# EAGLE design SGOv2 (EAGLE 6.3)
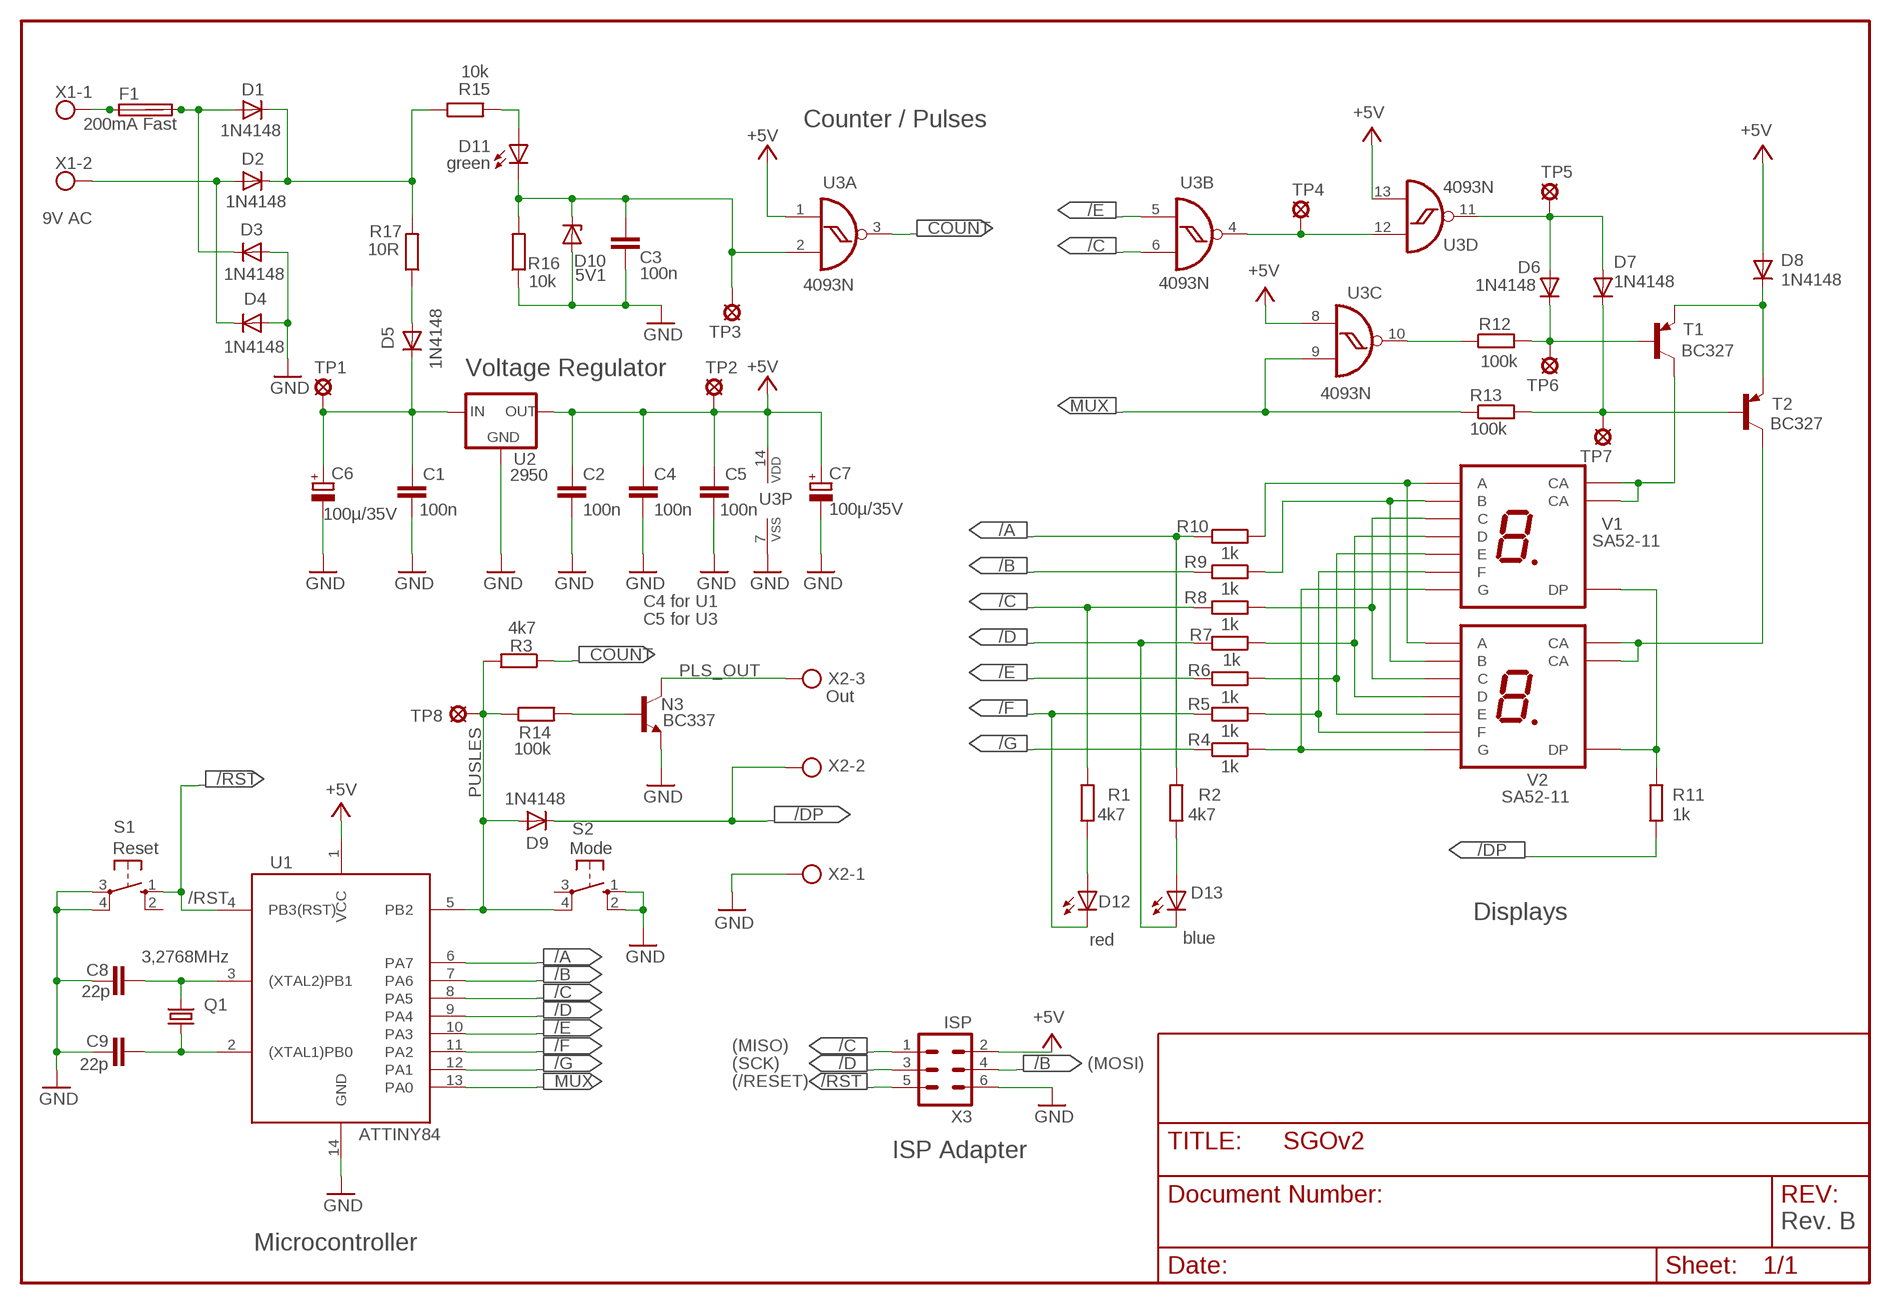
[diagram p0: schematic, sheet 1]

## Parts
C1  100n  C-EU025-024X044  [C025-024X044]
C2  100n  C-EU025-024X044  [C025-024X044]
C3  100n  C-EU025-024X044  [C025-024X044]
C4  100n  C-EU025-024X044  [C025-024X044]
C5  100n  C-EU025-024X044  [C025-024X044]
C6  100µ/35V  CPOL-EUE2.5-7  [E2,5-7]
C7  100µ/35V  CPOL-EUE2.5-7  [E2,5-7]
C8  22p  C-EU025-024X044  [C025-024X044]
C9  22p  C-EU025-024X044  [C025-024X044]
D1  1N4148  [DO35-10]
D2  1N4148  [DO35-10]
D3  1N4148  [DO35-10]
D4  1N4148  [DO35-10]
D5  1N4148  [DO35-10]
D6  1N4148  [DO35-10]
D7  1N4148  [DO35-10]
D8  1N4148  [DO35-10]
D9  1N4148  [DO35-10]
D10  5V1  ZPD  [DO35Z10]
D11  green  LED3MM  [LED3MM]
D12  red  LED3MM  [LED3MM]
D13  blue  LED3MM  [LED3MM]
F1  200mA Fast  SHK20Q  [SHK20Q]
F2  FUSESH22,5  [SH22,5]
N3  BC337  BC337-40  [TO92]
Q1  3,2768MHz  CRYSTALHC49S  [HC49/S]
R1  4k7  R-EU_0207/10  [0207/10]
R2  4k7  R-EU_0207/10  [0207/10]
R3  4k7  R-EU_0207/10  [0207/10]
R4  1k  R-EU_0207/10  [0207/10]
R5  1k  R-EU_0207/10  [0207/10]
R6  1k  R-EU_0207/10  [0207/10]
R7  1k  R-EU_0207/10  [0207/10]
R8  1k  R-EU_0207/10  [0207/10]
R9  1k  R-EU_0207/10  [0207/10]
R10  1k  R-EU_0207/10  [0207/10]
R11  1k  R-EU_0207/10  [0207/10]
R12  100k  R-EU_0207/10  [0207/10]
R13  100k  R-EU_0207/10  [0207/10]
R14  100k  R-EU_0207/10  [0207/10]
R15  10k  R-EU_0207/10  [0207/10]
R16  10k  R-EU_0207/10  [0207/10]
R17  10R  R-EU_0207/10  [0207/10]
S1  Reset  10-XX  [B3F-10XX]
S2  Mode  10-XX  [B3F-10XX]
T1  BC327  [TO92]
T2  BC327  [TO92]
TP1  V+  LSP10  [LSP10]
TP2  +5V  LSP10  [LSP10]
TP3  C-V5  LSP10  [LSP10]
TP4  /EC  LSP10  [LSP10]
TP5  EC  LSP10  [LSP10]
TP6  B-N1  LSP10  [LSP10]
TP7  B-N2  LSP10  [LSP10]
TP8  PLS  LSP10  [LSP10]
U1  ATTINY84  ATTINY24/44/84-PU  [DIL14]
U2  2950  78LXX  [TO92]
U3  4093N  [DIL14]
V1  SA52-11  [KB-SX52-11]
V2  SA52-11  [KB-SX52-11]
X1  9V AC  W237-102  [W237-102]
X2  Out  W237-103  [W237-103]
X3  ISP  ML6  [ML6]

## Nets
+5V: C2.1 C4.1 C5.1 C7.+ D8.A TP2.MP U1.1(VCC) U2.1(OUT) U3.1(A:I0) U3.8(C:I0) U3.13(D:I1) U3.14(P:VDD) X3.2
/A: R2.2 R10.2 U1.6(PA7)
/B: R9.2 U1.7(PA6) X3.4
/C: R1.2 R8.2 U1.8(PA5) U3.6(B:I1) X3.1
/D: D13.K(C) R7.2 U1.9(PA4) X3.3
/DP: D9.C R11.1 X2.2
/E: R6.2 U1.10(PA3) U3.5(B:I0)
/F: D12.K(C) R5.2 U1.11(PA2)
/G: R4.2 U1.12(PA1)
/RST: S1.1(S) U1.4(PB3(RST)) X3.5
COUNT: R3.1 U3.3(A:O)
GND: C1.2 C2.2 C3.2 C4.2 C5.2 C6.- C7.- C8.1 C9.1 D3.A D4.A D10.A N3.3(E) R16.1 S1.3(P) S1.4(P1) S2.1(S) S2.2(S1) U1.14(GND) U2.2(GND) U3.7(P:VSS) X2.1 X3.6
MUX: R13.1 U1.13(PA0) U3.9(C:I1)
N$1: R10.1 V1.P$7(A) V2.P$7(A)
N$2: R9.1 V1.P$6(B) V2.P$6(B)
N$3: R8.1 V1.P$4(C) V2.P$4(C)
N$4: R7.1 V1.P$2(D) V2.P$2(D)
N$5: R6.1 V1.P$1(E) V2.P$1(E)
N$6: R5.1 V1.P$9(F) V2.P$9(F)
N$7: R4.1 V1.P$10(G) V2.P$10(G)
N$8: T2.1(C) V2.P$3(CA) V2.P$8(CA)
N$9: T1.1(C) V1.P$3(CA) V1.P$8(CA)
N$10: D1.A D3.C F1.2A F2.2
N$11: D2.A D4.C X1.2
N$12: D1.C D2.C R15.1 R17.2
N$13: C1.1 C6.+ D5.C TP1.MP U2.3(IN)
N$14: D8.C T1.3(E) T2.3(E)
N$15: D7.C R13.2 T2.2(B) TP7.MP
N$16: D6.C R12.2 T1.2(B) TP6.MP
N$17: R12.1 U3.10(C:O)
N$18: D6.A D7.A TP5.MP U3.11(D:O)
N$19: TP4.MP U3.4(B:O) U3.12(D:I0)
N$20: D12.A R1.1
N$21: C8.2 Q1.2 U1.3((XTAL2)PB1)
N$22: D5.A R17.1
N$23: C9.2 Q1.1 U1.2((XTAL1)PB0)
N$24: C3.1 D10.C D11.K(C) R16.2 TP3.MP U3.2(A:I1)
N$25: D11.A R15.2
N$26: R11.2 V1.P$5(DP) V2.P$5(DP)
N$27: F1.1A F2.1 X1.1
N$28: D13.A R2.1
N$85: N3.2(B) R14.2
PLS_OUT: N3.1(C) X2.3
PUSLES: D9.A R3.2 R14.1 S2.4(P1) TP8.MP U1.5(PB2)
Unconnected: F1.1B F1.2B S1.2(S1) S2.3(P)

## Notes on the sheet
- Counter / Pulses
- Voltage Regulator
- C4 for U1
- C5 for U3
- Displays
- (MISO)
- (SCK) | (MOSI)
- (/RESET)
- ISP Adapter
- Rev. B
- Microcontroller

## Library data of the parts
C1-C5 C8 C9 = 09siemens-sta:C-EU: CAPACITOR, European symbol
C6 C7 = 09siemens-sta:CPOL-EU: POLARIZED CAPACITOR, European symbol
D1-D9 = 09siemens-sta:1N4148: DIODE high speed (Philips)
D10 = diode:ZPD: Z DIODE 500 mW
D11-D13 = 09siemens-sta:LED: LED OSRAM: - CHIPLED LG R971, LG N971, LY N971, LG Q971, LY Q971, LO R971, LY R971 LH N974, LH R974 LS Q976, LO Q976, LY Q976 LO Q996 - Hyper CHIPLED LW Q18S LB Q993, LB Q99A, LB R99A - SideLED LS A670, LO A670, LY A670, LG A670, LP A670 LB A673, LV A673, LT A673, LW A673 LH A674 LY A675 LS A676, LA A676, LO A676, LY A676, LW A676 LS A679, LY A679, LG A679 - Hyper Micro SIDELED® LS Y876, LA Y876, LO Y876, LY Y876 LT Y87S - SmartLED LW L88C, LW L88S LB L89C, LB L89S, LG L890 LS L89K, LO L89K, LY L89K LS L896, LA L896, LO L896, LY L896 - TOPLED LS T670, LO T670, LY T670, LG T670, LP T670 LSG T670, LSP T670, LSY T670, LOP T670, LYG T670 LG T671, LOG T671, LSG T671 LB T673, LV T673, LT T673, LW T673 LH T674 LS T676, LA T676, LO T676, LY T676, LB T676, LH T676, LSB T676, LW T676 LB T67C, LV T67C, LT T67C, LS T67K, LO T67K, LY T67K, LW E67C LS E67B, LA E67B, LO E67B, LY E67B, LB E67C, LV E67C, LT E67C LW T67C LS T679, LY T679, LG T679 LS T770, LO T770, LY T770, LG T770, LP T770 LB T773, LV T773, LT T773, LW T773 LH T774 LS E675, LA E675, LY E675, LS T675 LS T776, LA T776, LO T776, LY T776, LB T776 LHGB T686 LT T68C, LB T68C - Hyper Mini TOPLED® LB M676 - Mini TOPLED Santana® LG M470 LS M47K, LO M47K, LY M47K Source: http://www.osram.convergy.de - LUMILED® LXK2-PW12-R00, LXK2-PW12-S00, LXK2-PW14-U00, LXK2-PW14-V00 LXK2-PM12-R00, LXK2-PM12-S00, LXK2-PM14-U00 LXK2-PE12-Q00, LXK2-PE12-R00, LXK2-PE12-S00, LXK2-PE14-T00, LXK2-PE14-U00 LXK2-PB12-K00, LXK2-PB12-L00, LXK2-PB12-M00, LXK2-PB14-N00, LXK2-PB14-P00, LXK2-PB14-Q00 LXK2-PR12-L00, LXK2-PR12-M00, LXK2-PR14-Q00, LXK2-PR14-R00 LXK2-PD12-Q00, LXK2-PD12-R00, LXK2-PD12-S00 LXK2-PH12-R00, LXK2-PH12-S00 LXK2-PL12-P00, LXK2-PL12-Q00, LXK2-PL12-R00 Source: www.luxeon.com
F1 = 09siemens-sta:SHK20Q: FUSE HOLDER 5 x 20 mm, SH contact, E1207 Buerklin 64G6061
F2 = fuse:FUSE: Fuse; OC_FARNELL: unknown; OC_NEWARK: unknown
N3 = 09siemens-sta:BC337*: NPN Transistor
Q1 = 09siemens-sta:CRYSTAL: CRYSTAL
R1-R17 = 09siemens-sta:R-EU_: RESISTOR, European symbol
S1 S2 = 09siemens-sta:10-XX: OMRON SWITCH
T1 T2 = 09siemens-sta:BC327: PNP Transistor
TP1-TP8 = 09siemens-sta:LSP10: SOLDER PAD drill 1.0 mm, distributor Buerklin, 12H555
U1 = 09siemens-sta:ATTINY24/44/84
U2 = 09siemens-sta:78LXX: VOLTAGE REGULATOR
U3 = 09siemens-sta:4093: Quad 2-input NAND schmitt trigger
V1 V2 = 09siemens-sta:SA52-11
X1 = 09siemens-sta:W237-102: WAGO SCREW CLAMP
X2 = 09siemens-sta:W237-103: WAGO SCREW CLAMP
X3 = 09siemens-sta:ML6: HARTING

## Net classes
1 VCC: width 0.127 mm

## Board
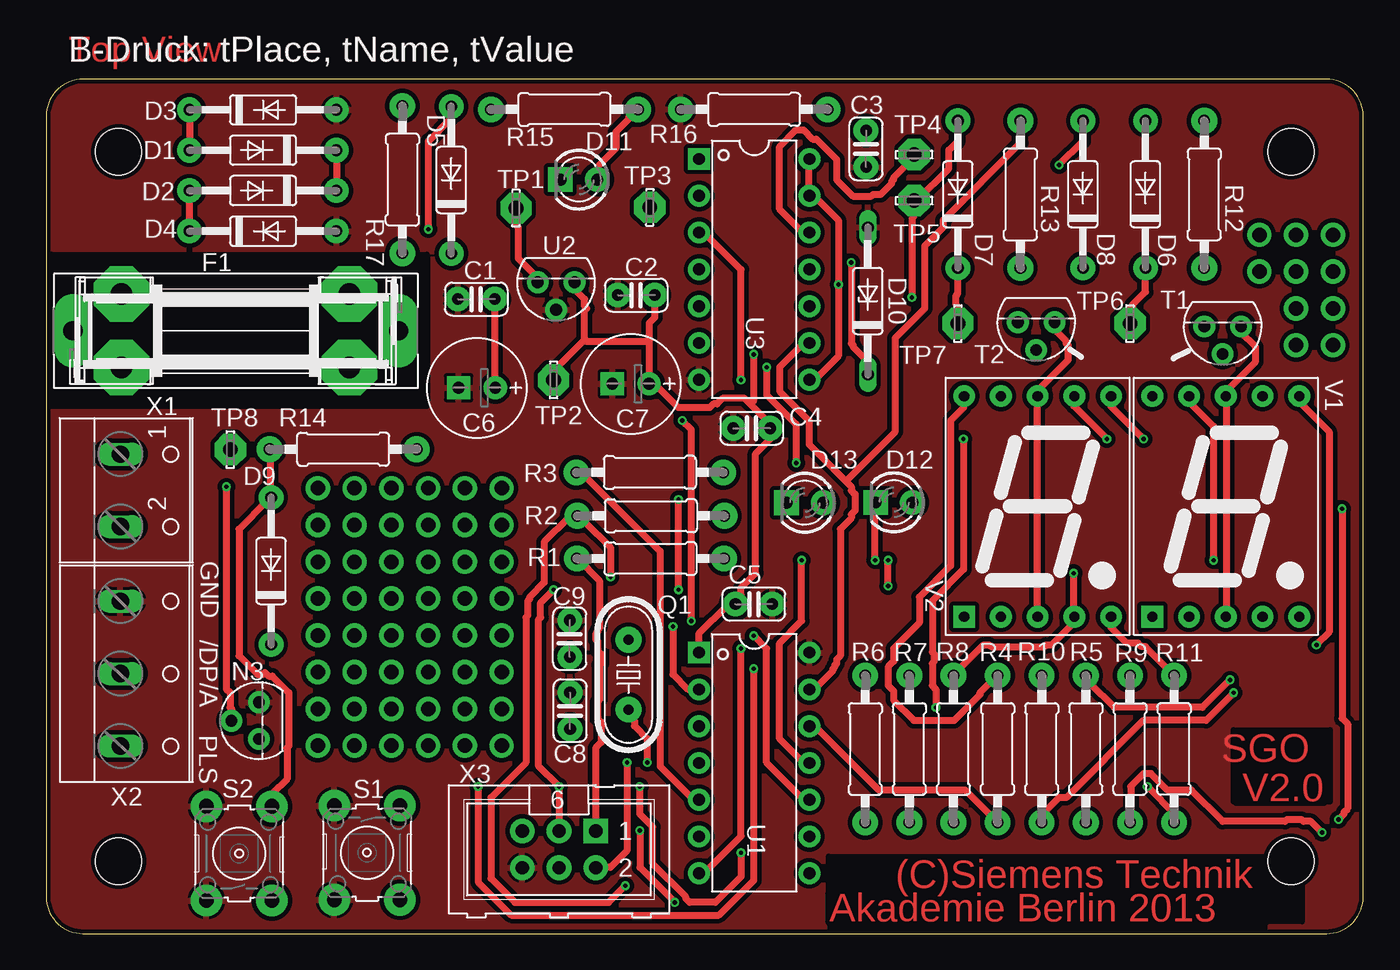
[diagram p1: board, top side]
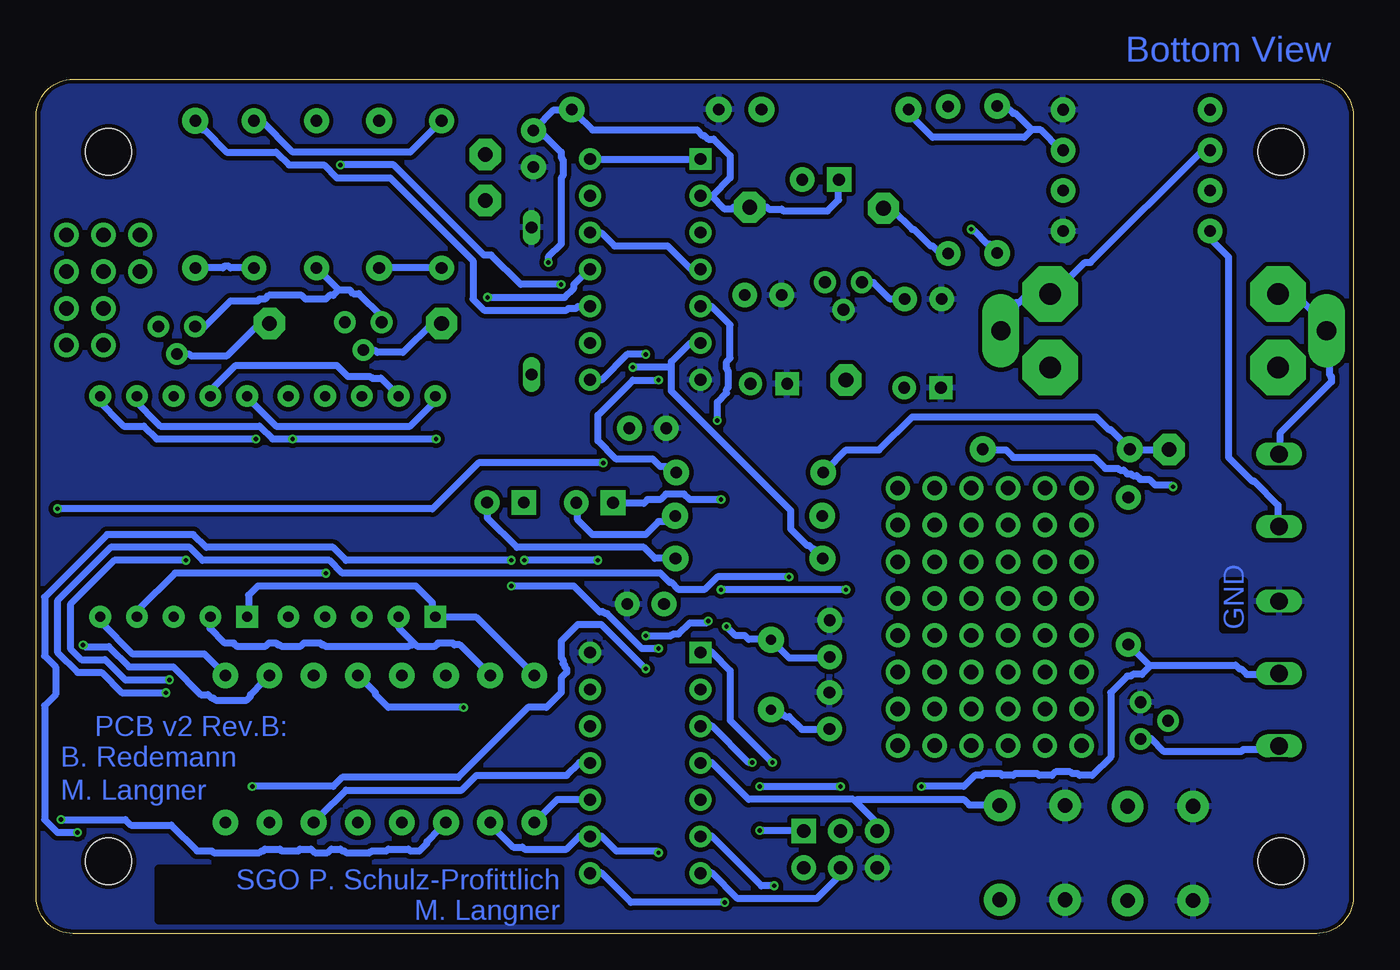
[diagram p2: board, bottom side, seen from below]

Size 91 x 59 mm. Coordinates in mm from the lower left corner, seen from the top.
Outline: 0,56.46 0,2.54 arc90 2.54,0 88.46,0 arc90 91,2.54 91,56.46 arc90 88.46,59 2.54,59 arc90 0,56.46
Copper layers (1*16): Top 0.035mm / dielectric 1.5mm / Bottom 0.035mm
Design rules: minimum track width 0.5mm, minimum drill 0.3mm, track to track 0.3mm, track to pad 0.3mm, pad to pad 0.15mm, via to via 0.15mm, smd to smd 0.15mm, copper to edge 0.3mm, drill to drill 0.2mm, minimum pad ring 0.2mm, minimum via ring 0.15mm, stop-mask expansion 0.075mm, vias tented up to drill 0mil, thermal gap 0.2mm
Holes 3.2 mm at 5,5 5,54 86,5 86,54
tRestrict: area 54.1,0.8 to 86.8,5.3; area 82,9.1 to 88.7,14; area 0.4,36.4 to 26.3,46.9

### Footprints (pad centres in the part's own frame; a part is rotated, then mirrored left to right if it is on the bottom)
C025-024X044 = drill 0.8 pad 1.7: 1 -1.27,0; 2 1.27,0
E2,5-7 = drill 0.813 pad 1.6: + -1.27,0 | drill 0.813 pad 1.6 square: - 1.27,0
DO35-10 = drill 0.8 pad 1.7: A 5.08,0; C -5.08,0
DO35Z10 = drill 0.813 long: A 5.08,0; C -5.08,0
LED3MM = drill 0.813 pad 1.7: A -1.27,0 | drill 0.813 pad 1.7 square: K 1.27,0
SHK20Q = drill 1.5 pad 3.81 octagon: 1A -7.874,2.54; 1B -7.874,-2.54; 2A 7.874,2.54; 2B 7.874,-2.54
SH22,5 = drill 1.321 pad 2.54 long: 1 -11.252,0; 2 11.252,0
TO92 = drill 0.813 pad 1.5: 1 -1.27,0; 2 0,1.905; 3 1.27,0
HC49/S = drill 0.7 pad 1.778: 1 -2.413,0; 2 2.413,0
0207/10 = drill 0.8 pad 1.778: 1 -5.08,0; 2 5.08,0
B3F-10XX = drill 1.016 pad 2.184: 1 -3.251,2.261; 2 3.251,2.261; 3 -3.251,-2.261; 4 3.251,-2.261
LSP10 = drill 1.016 pad 2.159 octagon: MP 0,0
DIL14 = drill 0.813 pad 1.5 square: 1 -7.62,-3.81 | drill 0.813 pad 1.5: 2 -5.08,-3.81; 3 -2.54,-3.81; 4 0,-3.81; 5 2.54,-3.81; 6 5.08,-3.81; 7 7.62,-3.81; 8 7.62,3.81; 9 5.08,3.81; 10 2.54,3.81; 11 0,3.81; 12 -2.54,3.81; 13 -5.08,3.81; 14 -7.62,3.81
KB-SX52-11 = drill 0.7 pad 1.5 square: P$1 -5.08,-7.62 | drill 0.7 pad 1.5: P$2 -2.54,-7.62; P$3 0,-7.62; P$4 2.54,-7.62; P$5 5.08,-7.62; P$6 5.08,7.62; P$7 2.54,7.62; P$8 0,7.62; P$9 -2.54,7.62; P$10 -5.08,7.62
W237-102 = drill 1.194 long: 1 -2.5,-1.27; 2 2.5,-1.27
W237-103 = drill 1.194 long: 1 -5,-1.29; 2 0,-1.29; 3 5,-1.29
ML6 = drill 0.914 pad 1.7 square: 1 -2.54,-1.27 | drill 0.914 pad 1.7: 2 -2.54,1.27; 3 0,-1.27; 4 0,1.27; 5 2.54,-1.27; 6 2.54,1.27

### Placement (x,y rotation side)
C1  29.72,43.81 180 top
C2  40.77,44.09 180 top
C3  56.64,54.2 270 top
C4  48.74,34.9 180 top
C5  48.9,22.76 0 top
C6  29.77,37.69 180 top
C7  40.39,37.97 180 top
C8  36.2,15.39 270 top
C9  36.17,20.37 270 top
D1  14.99,54.1 180 top
D2  14.99,51.31 180 top
D3  14.99,56.9 0 top
D4  14.99,48.51 0 top
D5  27.99,52.04 90 top
D6  75.95,51.05 90 top
D7  62.99,51.05 90 top
D8  71.63,51.05 90 top
D9  15.54,25.04 90 top
D10  56.77,43.69 90 top
D11  36.8,52.07 180 top
D12  58.58,29.78 180 top
D13  52.41,29.75 180 top
F1  13.08,41.63 0 top
F2  13.11,41.63 0 top
N3  14.71,14.71 90 top
Q1  40.23,17.88 270 top
R1  41.75,25.9 180 top
R2  41.78,28.85 180 top
R3  41.71,31.85 180 top
R4  65.74,12.75 270 top
R5  71.83,12.75 270 top
R6  56.59,12.75 270 top
R7  59.64,12.75 270 top
R8  62.69,12.75 270 top
R9  74.88,12.75 270 top
R10  68.78,12.75 270 top
R11  77.93,12.75 90 top
R12  80.01,51.05 270 top
R13  67.31,51.05 270 top
R14  20.52,33.45 0 top
R15  35.81,56.92 0 top
R16  48.92,56.92 0 top
R17  24.61,52.07 90 top
S1  22.17,5.59 270 top
S2  13.34,5.54 90 top
T1  81.28,41.94 180 top
T2  68.4,42.21 180 top
TP1  32.46,50.09 270 top
TP2  35.05,38.23 270 top
TP3  41.71,50.16 90 top
TP4  59.97,53.8 180 top
TP5  59.97,50.62 180 top
TP6  74.88,42.14 90 top
TP7  62.99,42.14 90 top
TP8  12.73,33.43 90 top
U1  48.92,11.79 270 top
U2  35.23,44.98 180 top
U3  48.92,45.87 270 top
V1  81.5,29.5 0 top
V2  68.5,29.5 0 top
X1  6.4,30.61 270 top
X2  6.42,17.96 270 top
X3  35.43,5.82 180 top

### Tracks (layer width: path | path; a pad name or v marks a point on that pad's centre or on a via)
+5V  (via drill 0.3)
  Top 0.5: U3.8 52.83,38.35 53.21,38.35 54.74,39.88 v54.74,44.83 54.74,49.28 53.21,50.8 52.7,50.8 52.7,50.93 U3.13 52.7,51.18 52.7,53.47 U3.14 | D8.A 71.63,54.74 v69.98,53.09 | 41.66,40.89 41.66,42.16 42.04,42.55 C2.1 | 41.66,40.89 C7.+ 41.78,37.85 42.16,37.85 43.69,36.32 45.85,36.32 46.1,36.58 46.35,36.58 46.74,36.96 48.26,36.96 48.64,36.58 | 37.21,41.02 37.21,43.05 37.34,43.18 37.21,43.31 37.21,43.81 36.45,44.58 36.45,44.96 U2.1 | 37.21,41.02 35.05,38.86 TP2.MP | 41.66,40.89 37.34,40.89 37.21,41.02 | U1.1 45.09,19.43 45.09,20.7 46.99,22.61 47.62,22.61 C5.1 47.62,23.11 47.75,23.11 48.01,23.37 48.01,23.88 49.02,24.89 49.02,33.15 50.04,34.16 50.04,34.8 C4.1 50.04,35.05 50.04,35.18 48.64,36.58 | v40.13,11.81 40.13,5.71 38.99,4.57 37.97,4.57 X3.2 | v48.9,40.01 48.9,36.83 48.64,36.58
  Bottom 0.5: U3.1 45.21,53.47 52.7,53.47 U3.14 | v69.98,53.09 66.29,53.09 60.07,46.86 59.56,46.86 57.53,44.83 v54.74,44.83 | v40.13,11.81 43.05,14.73 43.05,18.16 44.32,19.43 45.09,19.43 U1.1 | v48.9,40.01 50.16,40.01 51.94,38.23 52.7,38.23 U3.8
/A  (via drill 0.3)
  Top 0.5: v40.01,3.3 38.86,2.16 32.38,2.16 30.73,3.81 30.73,9.4 33.15,11.81 33.15,21.84 33.27,21.97 33.27,22.99 33.4,23.11 33.4,23.24 34.42,24.26 34.42,27.05 36.07,28.7 36.7,28.7 R2.2 36.7,28.45 37.21,28.45 38.99,26.67 v38.99,24.64 | v82.04,16.64 80.14,14.73 75.82,14.73 70.48,9.4 69.98,9.4 68.83,8.26 68.83,7.75 R10.2
  Bottom 0.5: v40.01,3.3 40.89,3.3 44.32,6.73 45.09,6.73 U1.6 | v82.04,16.64 85.09,16.64 86.49,18.03 88.14,18.03 89.53,19.43 89.53,22.99 85.85,26.67 80.39,26.67 79.5,25.78 70.74,25.78 69.85,24.89 47.88,24.89 47.24,24.26 47.12,24.26 46.61,23.75 44.83,23.75 43.94,24.64 v38.99,24.64
/B  (via drill 0.3)
  Top 0.5: v88.14,6.99 87.38,7.75 86.87,7.75 86.74,7.87 85.72,7.87 85.6,7.75 81.28,7.75 79.12,9.91 77.47,9.91 76.33,11.05 75.82,11.05 74.93,10.16 74.93,7.75 R9.2 | v58.17,24 v58.17,25.78 | v48.01,19.68 48.01,6.73 45.59,4.32 45.09,4.32 45.09,4.19 U1.7
  Bottom 0.5: U1.7 45.09,4.19 44.32,4.19 42.55,2.41 37.08,2.41 35.56,3.94 35.56,4.57 35.43,4.57 X3.4 | v88.14,6.99 89.53,6.99 90.42,7.87 90.42,15.75 89.66,16.51 89.66,18.41 90.42,19.18 90.42,23.24 86.11,27.56 80.14,27.56 79.25,26.67 70.48,26.67 69.6,25.78 v58.17,25.78 | v58.17,24 53.85,24 52.07,22.23 51.82,22.23 51.69,22.1 51.56,22.1 49.15,19.68 v48.01,19.68
/C  (via drill 0.3)
  Top 0.5: v43.43,2.16 41.02,4.57 v41.02,7.11 | v89.28,7.87 89.66,8.26 89.66,8.38 89.92,8.64 89.92,14.48 89.53,14.86 v89.53,29.34 | v51.82,32.51 51.82,35.18 49.78,37.21 v49.78,39.12 | X3.1 37.97,12.83 38.35,13.21 38.35,14.61 38.1,14.86 38.1,16 38.23,16.13 38.23,18.54 38.35,18.67 38.35,19.3 38.1,19.56 38.1,20.19 37.97,20.32 37.97,20.7 38.1,20.83 38.1,20.95 38.23,21.08 38.23,24.38 36.7,25.91 R1.2
  Bottom 0.5: v43.43,2.16 49.91,2.16 51.94,4.19 52.7,4.19 U1.8 | v41.02,7.11 37.97,7.11 X3.1 | 47.12,39.12 47.12,37.47 38.86,29.21 38.86,27.94 37.72,26.8 37.59,26.8 37.34,26.54 37.21,26.54 37.08,26.42 37.08,25.91 36.7,25.91 R1.2 | 47.12,39.12 47.12,39.5 45.85,40.77 45.21,40.77 U3.6 | v89.28,7.87 84.84,7.87 84.45,7.49 81.66,7.49 79.88,5.71 78.87,5.71 78.74,5.59 75.56,5.59 75.44,5.71 75.31,5.71 75.18,5.84 74.17,5.84 74.04,5.71 72.9,5.71 72.77,5.84 72.01,5.84 71.75,5.59 70.87,5.59 70.61,5.84 69.98,5.84 69.85,5.71 69.72,5.71 69.6,5.59 67.94,5.59 67.82,5.71 66.8,5.71 66.67,5.84 65.28,5.84 65.15,5.71 64.52,5.71 64.01,6.22 64.01,6.35 63.12,7.24 63.12,7.49 62.99,7.62 62.74,7.62 R8.2 | v89.53,29.34 63.63,29.34 60.45,32.51 v51.82,32.51 | 47.12,39.12 v49.78,39.12
/D  (via drill 0.3)
  Top 0.5: X3.3 v35.43,10.16 34.04,11.56 34.04,21.72 34.16,21.84 34.16,22.86 v35.05,23.75 | v41.02,10.16 41.02,8.26 41.91,7.37 41.91,4.83 44.2,2.54 44.2,2.41 44.45,2.16 46.23,2.16 48.01,3.94 v48.01,5.59 | v43.69,23.75 v43.69,29.97
  Bottom 0.5: R7.2 59.56,7.62 59.18,7.62 59.18,7.11 58.04,5.97 57.4,5.97 57.28,5.84 54.36,5.84 53.47,6.73 52.83,6.73 U1.9 52.58,6.73 51.94,6.73 50.93,5.71 48.13,5.71 v48.01,5.59 | v41.02,10.16 v35.43,10.16 | v43.69,29.97 45.85,29.97 46.23,30.35 47.5,30.35 47.88,29.97 48.77,29.97 49.02,29.72 51.05,29.72 D13.K | v35.05,23.75 v43.69,23.75
/DP  (via drill 0.3)
  Top 0.5: v76.07,10.16 77.98,8.26 77.98,7.75 R11.1 | v48.9,18.29 48.9,3.68 46.48,1.27 32.13,1.27 29.84,3.56 v29.84,10.16
  Bottom 0.5: 14.1,18.54 8.13,18.54 7.87,18.29 7.75,18.29 7.37,17.91 5.21,17.91 X2.2 | 14.1,18.54 15.37,19.81 15.37,19.94 15.49,19.94 D9.C | v76.07,10.16 70.48,10.16 69.85,10.79 61.85,10.79 57.02,15.62 55.75,15.62 54.74,16.64 54.74,17.65 54.36,18.03 54.36,18.29 54.48,18.41 54.48,18.54 54.61,18.67 54.61,18.92 54.74,19.05 54.74,20.19 53.59,21.34 51.94,21.34 v48.9,18.29 | v29.84,10.16 26.92,10.16 26.16,10.92 25.65,10.92 25.53,11.05 24.38,11.05 24.26,10.92 23.5,10.92 23.37,11.05 21.84,11.05 21.72,10.92 20.83,10.92 20.57,11.18 19.56,11.18 19.43,11.05 19.05,11.05 18.92,10.92 18.03,10.92 16.76,12.19 16.76,16.64 15.62,17.78 15.37,17.78 15.24,17.91 14.61,17.91 14.1,18.41 14.1,18.54
/E  (via drill 0.3)
  Top 0.5: v43.94,35.43 44.58,34.8 v44.58,21.59 | v48.9,20.57 49.78,19.68 49.78,11.81 52.2,9.4 52.7,9.4 52.7,9.27 U1.10
  Bottom 0.5: U1.10 52.83,9.27 54.99,9.27 56.13,8.13 56.13,7.62 56.52,7.62 R6.2 | v43.94,35.43 43.94,36.7 43.31,37.34 43.31,37.59 43.18,37.72 43.18,38.86 43.31,38.99 43.31,39.5 43.05,39.75 43.05,42.04 44.32,43.31 45.09,43.31 U3.5 | v44.58,21.59 44.7,21.46 45.85,21.46 46.61,20.7 46.99,20.7 47.12,20.57 v48.9,20.57
/F  (via drill 0.3)
  Top 0.5: v57.28,25.78 57.28,29.72 D12.K | v52.2,25.78 52.2,21.59 50.67,20.07 50.67,13.46 52.2,11.94 52.7,11.94 52.7,11.81 U1.11
  Bottom 0.5: U1.11 52.83,11.81 53.47,11.81 54.36,10.92 60.58,10.92 61.59,9.91 69.6,9.91 71.37,8.13 71.37,7.62 71.75,7.62 R5.2 | v52.2,25.78 v57.28,25.78
/G
  Top 0.5: U1.12 52.83,14.22 53.21,14.22 57.53,9.91 63.5,9.91 65.28,8.13 65.79,8.13 65.79,7.75 R4.2
/RST
  Bottom 0.5: 34.42,9.14 33.02,7.75 33.02,7.11 32.89,7.11 X3.5 | 34.42,9.14 34.54,9.27 41.78,9.27 44.32,11.81 45.09,11.81 U1.4 | S1.1 24.51,8.89 26.54,8.89 26.92,9.27 34.29,9.27 34.42,9.14
COUNT  (via drill 0.3)
  Top 0.5: v48.01,38.23 48.01,45.85 45.59,48.26 45.59,48.39 45.21,48.39 U3.3
  Bottom 0.5: v48.01,38.23 49.78,38.23 52.2,35.81 52.2,34.04 50.93,32.77 48.39,32.77 47.88,32.26 47.5,32.26 47.12,31.88 46.86,31.88 R3.1
GND
  pour Bottom: 98.15,65.43 98.15,64.26 98.48,-2.84 -4.62,-2.84 -4.62,65.48
  pour Top: -4.5,65.33 98.15,65.33 98.55,65.33 98.55,-3 -4.5,-3 -4.5,65.28
MUX
  Top 0.5: 55.24,31.24 52.7,33.78 52.7,35.43 50.67,37.47 50.67,39.12 52.2,40.64 52.7,40.64 52.7,40.77 U3.9 | 55.24,31.24 55.63,30.86 55.63,30.61 55.88,30.35 55.88,29.21 55.63,28.96 55.63,28.7 54.86,27.94 54.86,19.18 54.61,18.92 54.61,18.67 54.48,18.54 54.48,18.41 54.36,18.29 54.36,18.16 53.21,17.02 53.21,16.89 52.83,16.89 U1.13 | R13.1 67.31,54.61 61.98,49.28 61.98,48.77 60.71,47.5 60.71,43.18 58.67,41.15 58.67,34.67 55.24,31.24
N$1  (via drill 0.3)
  Top 0.5: v73.28,34.16 70.99,36.45 70.99,37.08 V2.P$7 | v61.47,15.62 61.47,16.89 61.21,17.14 61.21,18.67 61.34,18.8 61.34,19.3 61.21,19.43 61.21,22.99 63.37,25.15 v63.37,34.16
  Bottom 0.5: V1.P$7 84.07,37.08 84.33,37.08 84.33,36.96 82.42,35.05 75.56,35.05 74.68,34.16 v73.28,34.16 v63.37,34.16 | v61.47,15.62 66.67,15.62 67.56,16.51 67.56,16.64 68.33,17.4 68.33,17.65 68.45,17.78 68.71,17.78 R10.1
N$2  (via drill 0.3)
  Top 0.5: v75.82,34.16 73.53,36.45 73.53,37.08 V2.P$6 | v87.76,19.94 88.65,20.83 88.65,34.67 86.61,36.7 86.61,37.08 V1.P$6
  Bottom 0.5: v75.82,34.16 82.68,34.16 83.57,35.05 84.96,35.05 86.87,36.96 86.87,37.08 86.61,37.08 V1.P$6 | v87.76,19.94 87.63,19.81 85.98,19.81 84.58,18.41 81.53,18.41 79.63,16.51 79.12,16.51 78.87,16.26 78.74,16.26 78.61,16.13 76.45,16.13 76.2,16.38 76.2,16.51 75.31,17.4 75.31,17.65 75.18,17.78 74.93,17.78 R9.1
N$3  (via drill 0.3)
  Top 0.5: R8.1 62.74,17.91 62.74,18.03 62.87,18.03 64.77,19.94 65.15,19.94 65.28,19.81 68.96,19.81 69.09,19.94 69.47,19.94 70.99,21.46 70.99,21.84 V2.P$4 70.99,22.1 v70.99,24.89
  Bottom 0.5: v70.99,24.89 81.41,24.89 83.95,22.35 83.95,21.97 V1.P$4
N$4
  Bottom 0.5: 64.9,20.07 64.64,19.81 63.5,19.81 63.25,20.07 62.23,20.07 62.1,19.94 61.72,19.94 60.07,18.29 60.07,17.78 59.69,17.78 R7.1 | 64.9,20.07 65.91,21.08 65.91,21.84 V2.P$2 | V1.P$2 78.99,21.84 78.99,21.08 77.98,20.07 77.34,20.07 77.09,19.81 75.18,19.81 74.93,20.07 74.42,20.07 74.3,19.94 74.17,19.94 74.04,19.81 72.77,19.81 72.52,20.07 71.37,20.07 71.25,19.94 71.12,19.94 70.99,19.81 65.28,19.81 65.15,19.94 65.02,19.94 64.9,20.07
N$5
  Bottom 0.5: R6.1 56.64,17.78 57.02,17.78 57.02,18.29 60.58,21.84 63.37,21.84 V2.P$1 63.5,22.1 63.63,22.1 63.63,22.86 64.77,24 75.69,24 76.33,23.37 76.33,21.97 V1.P$1
N$6  (via drill 0.3)
  Top 0.5: v81.79,17.53 79.88,15.62 73.79,15.62 72.14,17.27 72.01,17.27 71.88,17.4 71.88,17.78 R5.1 | v80.64,25.78 80.64,35.05 78.99,36.7 78.99,37.08 V1.P$9
  Bottom 0.5: V2.P$9 66.04,37.21 67.18,38.35 67.82,38.35 67.94,38.48 69.47,38.48 70.23,39.24 77.22,39.24 78.87,37.59 78.87,37.21 V1.P$9 | v81.79,17.53 84.84,17.53 86.23,18.92 87.88,18.92 88.65,19.68 88.65,22.73 85.6,25.78 v80.64,25.78
N$7
  Top 0.5: R4.1 65.66,17.78 64.52,16.64 64.52,16.51 62.74,14.73 59.94,14.73 58.55,16.13 58.55,16.76 58.17,17.14 58.17,18.41 58.55,18.8 58.55,19.68 60.33,21.46 60.33,23.24 62.48,25.4 62.48,35.43 63.37,36.32 63.37,37.08 V2.P$10
  Bottom 0.5: V2.P$10 63.5,37.08 63.5,36.7 65.15,35.05 74.42,35.05 76.45,37.08 V1.P$10
N$8
  Top 0.5: V2.P$3 68.45,21.97 68.45,37.08 V2.P$8 68.45,37.34 68.45,37.47 70.61,39.62 70.61,40.64 70.48,40.77 70.48,40.89 69.72,41.66 69.72,42.16 T2.1
N$9
  Top 0.5: V1.P$3 81.53,21.97 81.53,37.08 V1.P$8 81.53,37.34 81.53,37.47 83.57,39.5 83.57,40.51 82.55,41.53 T1.1
N$10
  Top 0.5: D3.C D1.A
  Bottom 0.5: D1.A 10.41,54.1 18.16,46.35 18.54,46.35 19.68,45.21 19.68,44.2 20.95,44.2 F1.2A 21.08,44.2 22.48,44.2 23.11,43.56 23.37,43.56 23.37,42.16 23.88,41.66 24.26,41.66 F2.2
N$11
  Top 0.5: D4.C D2.A
  Bottom 0.5: D4.C 9.78,48.51 9.78,47.88 8.64,46.74 8.64,32.89 6.99,31.24 6.86,31.24 5.21,29.59 5.21,28.19 X1.2
N$12
  Top 0.5: D1.C D2.C
  Bottom 0.5: R17.2 24,57.15 23.5,56.64 23.37,56.64 22.23,55.5 | 22.23,55.5 21.59,55.5 20.19,54.1 D1.C | 22.23,55.5 22.73,54.99 29.08,54.99 30.48,56.39 30.48,56.9 30.73,56.9 R15.1
N$13
  Top 0.5: C1.1 30.99,37.72 C6.+ | TP1.MP 32.51,50.04 32.51,48.9 32.64,48.77 32.64,46.61 33.91,45.34 33.91,45.09 U2.3
  Bottom 0.5: D5.C 28.07,46.99 28.57,46.99 29.08,47.5 29.21,47.5 30.35,48.64 30.48,48.64 31.88,50.04 32.38,50.04 TP1.MP | C1.1 32,43.81 33.15,44.96 33.91,44.96 U2.3
N$14
  Bottom 0.5: 70.1,44.45 69.34,44.45 69.09,44.2 68.71,44.2 67.18,42.67 67.18,42.29 T2.3 | 70.1,44.45 71.5,45.85 71.5,45.97 D8.C | 70.1,44.45 70.48,44.07 70.74,44.07 70.99,43.81 72.39,43.81 72.64,44.07 74.93,44.07 75.18,43.81 75.56,43.81 75.69,43.69 77.6,43.69 79.38,41.91 80.01,41.91 T1.3
N$15
  Top 0.5: D7.C 62.99,44.2 62.87,44.07 62.87,43.43 62.99,43.31 TP7.MP
  Bottom 0.5: T2.2 68.33,40.26 67.56,40.26 67.44,40.13 65.66,40.13 63.63,42.16 62.99,42.16 TP7.MP | D7.C R13.2
N$16
  Top 0.5: D6.C 75.95,44.32 75.06,43.43 75.06,43.31 74.93,43.18 74.93,42.16 TP6.MP
  Bottom 0.5: T1.2 81.28,40.01 80.39,40.01 80.26,39.88 77.85,39.88 75.56,42.16 74.93,42.16 TP6.MP | R12.2 78.11,45.97 77.98,46.1 77.72,46.1 77.6,45.97 D6.C
N$17
  Bottom 0.5: R12.1 79.63,56.13 79.63,55.63 79.5,55.5 79.38,55.5 77.85,53.98 74.42,53.98 73.53,53.09 71.12,53.09 70.23,52.2 66.55,52.2 60.83,46.48 60.83,43.81 60.07,43.05 54.36,43.05 54.23,43.18 53.72,43.18 53.59,43.31 52.83,43.31 U3.10
N$18  (via drill 0.3)
  Top 0.5: v59.82,43.94 59.82,49.4 59.94,49.53 59.94,50.55 TP5.MP 60.2,50.67 62.36,52.83 62.36,54.1 62.99,54.74 D7.A
  Bottom 0.5: v59.82,43.94 54.48,43.94 53.85,44.58 53.85,44.83 52.83,45.85 U3.11 | D6.A 75.44,56.13 73.28,53.98 65.15,53.98 63.12,56.01 63.12,56.13 D7.A
N$19
  Top 0.5: TP4.MP 59.94,53.72 59.94,53.21 59.82,53.09 59.44,53.09 58.55,52.2 58.55,52.07 58.42,51.94 58.42,51.82 57.66,51.05 57.15,51.05 57.02,50.93 55.75,50.93 54.61,52.07 54.61,53.47 53.21,54.86 52.96,54.86 52.32,55.5 51.82,55.5 50.67,54.36 50.67,50.04 52.58,48.13 52.7,48.13 52.7,48.39 U3.12
  Bottom 0.5: U3.4 45.21,45.85 45.72,45.85 47.37,47.5 51.05,47.5 51.94,48.39 52.7,48.39 U3.12
N$20
  Bottom 0.5: D12.A 59.82,29.72 59.82,28.7 57.78,26.67 49.02,26.67 48.26,25.91 46.86,25.91 R1.1
N$21  (via drill 0.3)
  Top 0.5: v41.53,11.81 41.53,13.46 40.64,14.35 40.64,14.73 40.26,15.11 40.26,15.37 Q1.2
  Bottom 0.5: v41.53,11.81 41.78,11.81 44.32,14.35 45.09,14.35 U1.3 | C8.2 36.2,14.1 38.1,14.1 38.99,14.99 39.24,14.99 39.37,15.11 39.5,15.11 39.88,15.49 40.13,15.49 Q1.2
N$22  (via drill 0.3)
  Top 0.5: v26.42,48.64 26.42,54.74 27.94,56.26 27.94,57.02 D5.A
  Bottom 0.5: v26.42,48.64 26.29,48.51 26.16,48.51 25.27,47.62 25.15,47.62 25.02,47.5 25.02,46.99 R17.1
N$23  (via drill 0.3)
  Top 0.5: v43.31,21.21 43.31,17.91 44.32,16.89 45.09,16.89 U1.2
  Bottom 0.5: v43.31,21.21 42.67,20.57 42.04,20.57 41.78,20.32 40.26,20.32 Q1.1 40.13,20.07 40.01,20.07 38.99,19.05 36.2,19.05 C9.2
N$24  (via drill 0.3)
  Top 0.5: D10.C 56.77,39.5 55.75,40.51 55.75,40.64 55.63,40.77 v55.63,46.35
  Bottom 0.5: 44.32,50.93 45.09,50.93 U3.2 | 44.32,50.93 43.43,50.04 42.93,50.04 42.8,50.16 TP3.MP 40.51,50.16 40.39,50.04 39.5,50.04 39.37,49.91 36.32,49.91 35.56,50.67 35.56,52.07 D11.K | v55.63,46.35 55.63,46.74 54.74,47.62 54.74,52.2 54.61,52.32 54.61,53.47 54.74,53.59 54.74,53.98 55.88,55.12 56.01,55.12 56.39,55.5 56.64,55.5 C3.1 56.52,55.63 55.24,56.9 54.1,56.9 R16.2 54.1,56.64 53.72,56.64 52.58,55.5 45.34,55.5 44.96,55.12 44.83,55.12 44.58,54.86 44.2,54.86 43.05,53.72 43.05,52.2 44.32,50.93
N$25
  Top 0.5: R15.2 40.89,56.52 40.39,56.52 40.26,56.39 40.26,56.26 39.37,55.37 39.37,54.23 38.1,52.96 38.1,52.07 D11.A
N$26
  Top 0.5: V2.P$5 73.53,21.84 73.53,21.21 74.68,20.07 75.44,20.07 75.69,19.81 75.95,19.81 77.47,18.29 77.98,18.29 77.98,17.91 R11.2
  Bottom 0.5: V1.P$5 86.49,21.84 86.49,21.46 84.33,19.3 79.38,19.3 78.36,18.29 78.36,17.78 77.98,17.78 R11.2
N$27
  Bottom 0.5: X1.1 5.08,33.15 5.08,34.54 1.52,38.1 1.52,38.48 1.65,38.61 1.65,41.66 1.78,41.66 F2.1 1.78,41.91 4.06,44.2 5.21,44.2 F1.1A
N$28
  Bottom 0.5: D13.A 53.59,29.72 53.59,28.57 52.58,27.56 48.9,27.56 48.01,28.45 47.5,28.45 47.12,28.83 46.86,28.83 R2.1
N$29  (via drill 1 pad 1.68)
  other vias: 28.93,25.68
N$30  (via drill 1 pad 1.68)
  other vias: 28.93,23.14
N$31  (via drill 1 pad 1.68)
  other vias: 28.93,20.6
N$32  (via drill 1 pad 1.68)
  other vias: 23.85,20.6
N$33  (via drill 1 pad 1.68)
  other vias: 26.39,20.6
N$34  (via drill 1 pad 1.68)
  other vias: 26.39,23.14
N$35  (via drill 1 pad 1.68)
  other vias: 26.39,25.68
N$36  (via drill 1 pad 1.68)
  other vias: 23.85,25.68
N$37  (via drill 1 pad 1.68)
  other vias: 21.31,25.68
N$38  (via drill 1 pad 1.68)
  other vias: 28.93,18.06
N$39  (via drill 1 pad 1.68)
  other vias: 28.93,15.52
N$40  (via drill 1 pad 1.68)
  other vias: 28.93,12.98
N$41  (via drill 1 pad 1.68)
  other vias: 23.85,12.98
N$42  (via drill 1 pad 1.68)
  other vias: 26.39,12.98
N$43  (via drill 1 pad 1.68)
  other vias: 26.39,15.52
N$44  (via drill 1 pad 1.68)
  other vias: 26.39,18.06
N$45  (via drill 1 pad 1.68)
  other vias: 21.31,23.14
N$46  (via drill 1 pad 1.68)
  other vias: 23.85,23.14
N$47  (via drill 1 pad 1.68)
  other vias: 21.31,20.6
N$48  (via drill 1 pad 1.68)
  other vias: 18.77,20.6
N$49  (via drill 1 pad 1.68)
  other vias: 18.77,23.14
N$50  (via drill 1 pad 1.68)
  other vias: 18.77,25.68
N$52  (via drill 1 pad 1.68)
  other vias: 28.93,30.76
N$53  (via drill 1 pad 1.68)
  other vias: 28.93,28.22
N$54  (via drill 1 pad 1.68)
  other vias: 23.85,28.22
N$55  (via drill 1 pad 1.68)
  other vias: 26.39,28.22
N$56  (via drill 1 pad 1.68)
  other vias: 26.39,30.76
N$60  (via drill 1 pad 1.68)
  other vias: 21.31,30.76
N$61  (via drill 1 pad 1.68)
  other vias: 23.85,18.06
N$62  (via drill 1 pad 1.68)
  other vias: 21.31,18.06
N$63  (via drill 1 pad 1.68)
  other vias: 21.31,15.52
N$64  (via drill 1 pad 1.68)
  other vias: 23.85,15.52
N$65  (via drill 1 pad 1.68)
  other vias: 21.31,12.98
N$66  (via drill 1 pad 1.68)
  other vias: 18.77,12.98
N$67  (via drill 1 pad 1.68)
  other vias: 18.77,15.52
N$68  (via drill 1 pad 1.68)
  other vias: 18.77,18.06
N$69  (via drill 1 pad 1.68)
  other vias: 23.85,30.76
N$70  (via drill 1 pad 1.68)
  other vias: 21.31,28.22
N$71  (via drill 1 pad 1.68)
  other vias: 18.77,28.22
N$72  (via drill 1 pad 1.68)
  other vias: 18.77,30.76
N$77  (via drill 1 pad 1.68)
  other vias: 31.47,12.98
N$78  (via drill 1 pad 1.68)
  other vias: 31.47,15.52
N$79  (via drill 1 pad 1.68)
  other vias: 31.47,18.06
N$83  (via drill 1 pad 1.68)
  other vias: 31.47,20.6
N$84  (via drill 1 pad 1.68)
  other vias: 31.47,23.14
N$85  (via drill 0.3)
  Top 0.5: v12.45,30.86 12.45,16.89 12.7,16.64 12.7,15.62 12.83,15.49 12.83,14.73 N3.2
  Bottom 0.5: v12.45,30.86 12.57,30.99 13.72,30.99 14.1,31.37 14.73,31.37 14.99,31.62 15.24,31.62 15.37,31.75 15.62,31.75 15.88,32 16.13,32 16.26,32.13 17.14,32.13 17.91,32.89 23.5,32.89 24,33.4 25.53,33.4 R14.2
N$86  (via drill 1 pad 1.68)
  other vias: 31.47,25.68
N$90  (via drill 1 pad 1.68)
  other vias: 31.47,28.22
N$91  (via drill 1 pad 1.68)
  other vias: 31.47,30.76
N$97  (via drill 1 pad 1.68)
  other vias: 83.82,48.26
N$98  (via drill 1 pad 1.68)
  other vias: 86.36,48.26
N$99  (via drill 1 pad 1.68)
  other vias: 88.9,48.26
N$100  (via drill 1 pad 1.68)
  other vias: 88.9,45.72
N$101  (via drill 1 pad 1.68)
  other vias: 86.36,45.72
N$102  (via drill 1 pad 1.68)
  other vias: 86.36,43.18
N$103  (via drill 1 pad 1.68)
  other vias: 88.9,43.18
N$104  (via drill 1 pad 1.68)
  other vias: 88.9,40.64
N$105  (via drill 1 pad 1.68)
  other vias: 86.36,40.64
N$106  (via drill 1 pad 1.68)
  other vias: 83.82,45.72
PLS_OUT
  Bottom 0.5: N3.1 14.61,13.46 13.97,13.46 13.08,12.57 7.75,12.57 7.62,12.7 6.6,12.7 6.35,12.95 5.21,12.95 X2.3
PUSLES
  Top 0.5: R14.1 15.49,33.4 15.49,30.23 D9.A 15.24,30.23 15.24,29.84 13.34,27.94 13.34,19.18 14.61,17.91 14.99,17.91 15.11,18.03 15.37,17.78 15.62,17.78 16.76,16.64 16.76,12.95 16.64,12.83 16.64,10.67 15.62,9.65 15.62,8.89 S2.4 | U1.5 45.09,9.27 44.7,9.27 42.42,11.56 42.42,26.42 37.21,31.62 36.58,31.62 36.58,31.75 R3.2
  Bottom 0.5: TP8.MP 12.83,33.4 15.37,33.4 R14.1 15.49,33.66 15.75,33.91 15.88,33.91 16.76,34.8 16.89,34.8 17.78,35.69 30.48,35.69 32.77,33.4 35.05,33.4 36.45,32 36.45,31.88 36.58,31.88 R3.2

### Text on the board
Top: Top View | SGO | V2.0 | (C)Siemens Technik | Akademie Berlin 2013
Bottom: Bottom View | GND | PCB v2 Rev.B: | B. Redemann | M. Langner | SGO P. Schulz-Profittlich / M. Langner
tPlace: B-Druck: tPlace, tName, tValue | ° | GND | /DP/A | ° | PLS